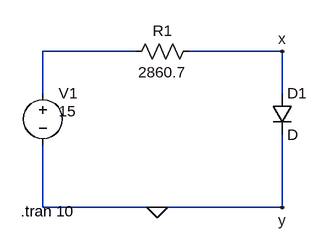
[diagram p0: schematic 1_1_R_value_to_get_diode_current_as_5mA.asc]
1_1_R_value_to_get_diode_current_as_5mA.asc, the LTspice schematic file:
Version 4
SHEET 1 880 680
WIRE 256 80 112 80
WIRE 480 80 336 80
WIRE 112 144 112 80
WIRE 480 144 480 80
WIRE 112 320 112 224
WIRE 288 320 112 320
WIRE 480 320 480 208
WIRE 480 320 288 320
FLAG 288 320 0
FLAG 480 80 x
FLAG 480 320 y
SYMBOL voltage 112 128 R0
WINDOW 3 24 44 Left 2
WINDOW 123 0 0 Left 0
WINDOW 39 0 0 Left 0
SYMATTR InstName V1
SYMATTR Value 15
SYMBOL res 352 64 R90
WINDOW 0 0 56 VBottom 2
WINDOW 3 32 56 VTop 2
SYMATTR InstName R1
SYMATTR Value 2860.7
SYMBOL diode 464 144 R0
SYMATTR InstName D1
TEXT 78 326 Left 2 !.tran 10

The netlist it stands for:
* 1_1_R_value_to_get_diode_current_as_5mA.asc
V1 N001 0 15
R1 x N001 2860.7
D1 x 0 D
.model D D
.lib standard.dio
.tran 10
.backanno
.end